# EAGLE design rectifier-power (EAGLE 5.07)
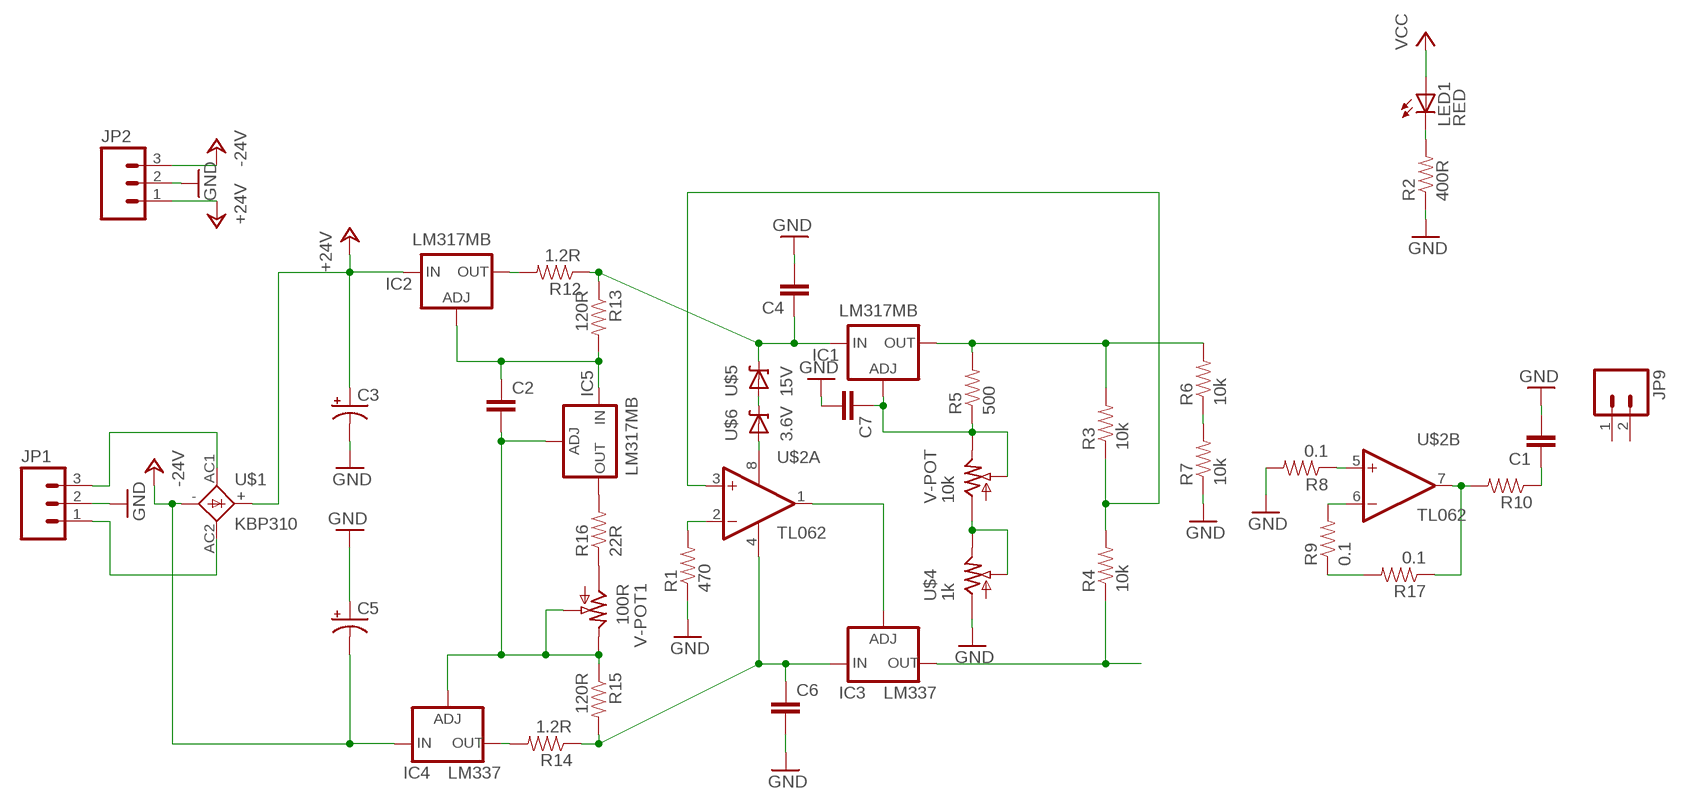
[diagram p0: schematic, sheet 1]

## Parts
C1  CAPPTH1  [CAP-PTH-5MM]
C2  CAPPTH1  [CAP-PTH-5MM]
C3  CAP_POLPTH3  [CPOL-RADIAL-1000UF-63V]
C4  CAPPTH1  [CAP-PTH-5MM]
C5  CAP_POLPTH3  [CPOL-RADIAL-1000UF-63V]
C6  CAPPTH1  [CAP-PTH-5MM]
C7  CAPPTH1  [CAP-PTH-5MM]
IC1  LM317MB  [TO220L1]
IC2  LM317MB  [TO220L1]
IC3  LM337  LM337TL  [337TL]
IC4  LM337  LM337TL  [337TL]
IC5  LM317MB  [TO220L1]
JP1  M03HT-396  [HT-396-3]
JP2  M03HT-396  [HT-396-3]
JP9  CON-02-XH  [XH-1X2-LONG-LOCK]
LED1  RED  LEDSIDELED  [OSRAM-SIDELED]
R1  470  RESISTOR1/4W  [AXIAL-0.3]
R2  400R  RESISTOR1/4W  [AXIAL-0.3]
R3  10k  RESISTOR1/4W  [AXIAL-0.3]
R4  10k  RESISTOR1/4W  [AXIAL-0.3]
R5  500  RESISTOR1/4W  [AXIAL-0.3]
R6  10k  RESISTOR1/4W  [AXIAL-0.3]
R7  10k  RESISTOR1/4W  [AXIAL-0.3]
R8  0.1  RESISTOR1/4W  [AXIAL-0.3]
R9  0.1  RESISTOR1/4W  [AXIAL-0.3]
R10  RESISTOR1/4W  [AXIAL-0.3]
R12  1.2R  RESISTOR1/4W  [AXIAL-0.3]
R13  120R  RESISTOR1/4W  [AXIAL-0.3]
R14  1.2R  RESISTOR1/4W  [AXIAL-0.3]
R15  120R  RESISTOR1/4W  [AXIAL-0.3]
R16  22R  RESISTOR1/4W  [AXIAL-0.3]
R17  0.1  RESISTOR1/4W  [AXIAL-0.3]
U$1  KBP310  RECTIFIER-BRIDGE  [KBP310]
U$2  TL062  TL062SO8  [SO08]
U$4  1k  POTPANNEL  [POT-PANNEL]
U$5  15V  DIODE-ZENERPTH  [DIODE-ZENER]
U$6  3.6V  DIODE-ZENERPTH  [DIODE-ZENER]
V-POT  10k  POTPANNEL  [POT-PANNEL]
V-POT1  100R  POTPANNEL  [POT-PANNEL]

## Nets
+24V: C3.1(+) IC2.3(IN) JP2.1 U$1.+
-24V: C5.2(-) IC4.2(IN) JP2.3 U$1.-
GND: C1.2 C3.2(-) C4.2 C5.1(+) C6.2 C7.2 JP1.2 JP2.2 R1.P$1 R2.P$1 R7.P$1 R8.P$2 U$4.A
N$1: IC1.2(OUT) R3.P$2 R5.P$2 R6.P$2
N$3: JP1.3 U$1.AC1
N$4: LED1.C R2.P$2
N$5: U$2.8(P:V+) U$6.P$2(A)
N$6: C4.1 IC1.3(IN) R12.P$1 R13.P$1 U$5.P$1(C)
N$7: JP1.1 U$1.AC2
N$8: U$5.P$2(A) U$6.P$1(C)
N$9: IC2.2(OUT) R12.P$2
N$10: C2.1 IC2.1(ADJ) IC5.3(IN) R13.P$2
N$11: IC3.1(ADJ) U$2.1(A:OUT)
N$12: R1.P$2 U$2.2(A:-IN)
N$14: IC3.3(OUT) R4.P$1
N$15: R8.P$1 U$2.5(B:+IN)
N$16: R9.P$2 U$2.6(B:-IN)
N$17: C7.1 IC1.1(ADJ) R5.P$1 V-POT.E V-POT.S
N$18: U$4.E U$4.S V-POT.A
N$19: R6.P$1 R7.P$2
N$20: IC4.3(OUT) R14.P$2
N$21: R3.P$1 R4.P$2 U$2.3(A:+IN)
N$22: C1.1 R10.P$1
N$23: R9.P$1 R17.P$2
N$24: C6.1 IC3.2(IN) R14.P$1 R15.P$2 U$2.4(P:V-)
N$25: C2.2 IC4.1(ADJ) IC5.1(ADJ) R15.P$1 V-POT1.E V-POT1.S
N$26: IC5.2(OUT) R16.P$2
N$27: R16.P$1 V-POT1.A
N$28: R10.P$2 R17.P$1 U$2.7(B:OUT)
VCC: LED1.A
Unconnected: JP9.1 JP9.2

## Library data of the parts
C1 C2 C4 C6 C7 = digital-toy:CAP: Capacitor Standard 0603 ceramic capacitor, and 0.1" leaded capacitor.
C3 C5 = digital-toy:CAP_POL: Capacitor Polarized These are standard SMD and PTH capacitors. Normally 10uF, 47uF, and 100uF in electrolytic and tantalum varieties. Always verify the external diameter of the through hole cap, it varies with capacity, voltage, and manufacturer. The EIA devices should be standard. PANASONIC_D size: 6.5mmx6.5mmx5.5mm, 100uf (taobao:6.3mmx5.5mm), same as CVL0605 153cvl0405 size: 4mmx4mmx5.5mm, 10uf (taobao:4mmx5.5mm) ct6032 typical 47uF Tantalum, comment by hyl.
IC1 IC2 IC5 = v-reg:LM317?*: 500 mA Adjustable Output Positive Voltage Regulator Source: http://www.onsemi.co.jp .. LM317M-D.PDF
IC3 IC4 = v-reg:LM337TL: VOLTAGE REGULATOR
JP1 JP2 = digital-toy:M03: Header 3 Standard 3-pin 0.1" header. Use with straight break away headers (SKU : PRT-00116), right angle break away headers (PRT-00553), swiss pins (PRT-00743), machine pins (PRT-00117), and female headers (PRT-00115). Molex polarized connector foot print use with SKU : PRT-08232 with associated crimp pins and housings.
JP9 = digital-toy:CON-02: Header 2 Standard 2-pin 0.1" header. Use with straight break away headers (SKU : PRT-00116), right angle break away headers (PRT-00553), swiss pins (PRT-00743), machine pins (PRT-00117), and female headers (PRT-00115). Molex polarized connector foot print use with SKU : PRT-08233 with associated crimp pins and housings.
LED1 = led:LED: LED OSRAM: - CHIPLED LG R971, LG N971, LY N971, LG Q971, LY Q971, LO R971, LY R971 LH N974, LH R974 LS Q976, LO Q976, LY Q976 LO Q996 - Hyper CHIPLED LW Q18S LB Q993, LB Q99A, LB R99A - SideLED LS A670, LO A670, LY A670, LG A670, LP A670 LB A673, LV A673, LT A673, LW A673 LH A674 LY A675 LS A676, LA A676, LO A676, LY A676, LW A676 LS A679, LY A679, LG A679 - Hyper Micro SIDELED® LS Y876, LA Y876, LO Y876, LY Y876 LT Y87S - SmartLED LW L88C, LW L88S LB L89C, LB L89S, LG L890 LS L89K, LO L89K, LY L89K LS L896, LA L896, LO L896, LY L896 - TOPLED LS T670, LO T670, LY T670, LG T670, LP T670 LSG T670, LSP T670, LSY T670, LOP T670, LYG T670 LG T671, LOG T671, LSG T671 LB T673, LV T673, LT T673, LW T673 LH T674 LS T676, LA T676, LO T676, LY T676, LB T676, LH T676, LSB T676, LW T676 LB T67C, LV T67C, LT T67C, LS T67K, LO T67K, LY T67K, LW E67C LS E67B, LA E67B, LO E67B, LY E67B, LB E67C, LV E67C, LT E67C LW T67C LS T679, LY T679, LG T679 LS T770, LO T770, LY T770, LG T770, LP T770 LB T773, LV T773, LT T773, LW T773 LH T774 LS E675, LA E675, LY E675, LS T675 LS T776, LA T776, LO T776, LY T776, LB T776 LHGB T686 LT T68C, LB T68C - Hyper Mini TOPLED® LB M676 - Mini TOPLED Santana® LG M470 LS M47K, LO M47K, LY M47K Source: http://www.osram.convergy.de LUXEON: - LUMILED® LXK2-PW12-R00, LXK2-PW12-S00, LXK2-PW14-U00, LXK2-PW14-V00 LXK2-PM12-R00, LXK2-PM12-S00, LXK2-PM14-U00 LXK2-PE12-Q00, LXK2-PE12-R00, LXK2-PE12-S00, LXK2-PE14-T00, LXK2-PE14-U00 LXK2-PB12-K00, LXK2-PB12-L00, LXK2-PB12-M00, LXK2-PB14-N00, LXK2-PB14-P00, LXK2-PB14-Q00 LXK2-PR12-L00, LXK2-PR12-M00, LXK2-PR14-Q00, LXK2-PR14-R00 LXK2-PD12-Q00, LXK2-PD12-R00, LXK2-PD12-S00 LXK2-PH12-R00, LXK2-PH12-S00 LXK2-PL12-P00, LXK2-PL12-Q00, LXK2-PL12-R00 Source: www.luxeon.com KINGBRIGHT: KA-3528ASYC Source: www.kingbright.com
R1-R10 R12-R17 = digital-toy:RESISTOR: Resistor Basic schematic elements and footprints for 0603, 1206, and PTH 1/10th watt (small) resistors. digital-toy copy vertical mount of axial-0.3 from rcl.lbr : the 0207/xx
U$1 = digital-toy:RECTIFIER-BRIDGE: refctifier bridge kbp310:14.4mmx11.1mm by hyl dtoy 2011/4/16
U$2 = digital-toy:TL062: Linear Devices dual Operational amplifiers, JFET-Input Stage Input offset voltage:typical 3mV(25C)
U$4 V-POT V-POT1 = digital-toy:POT: POT digital toy POT, 3296 multi turn, blue-white ... hyl 8/07/2001
U$5 U$6 = digital-toy:DIODE-ZENER: Zener Diode Production Part - 8199 3.4V Zener Voltage

## Board
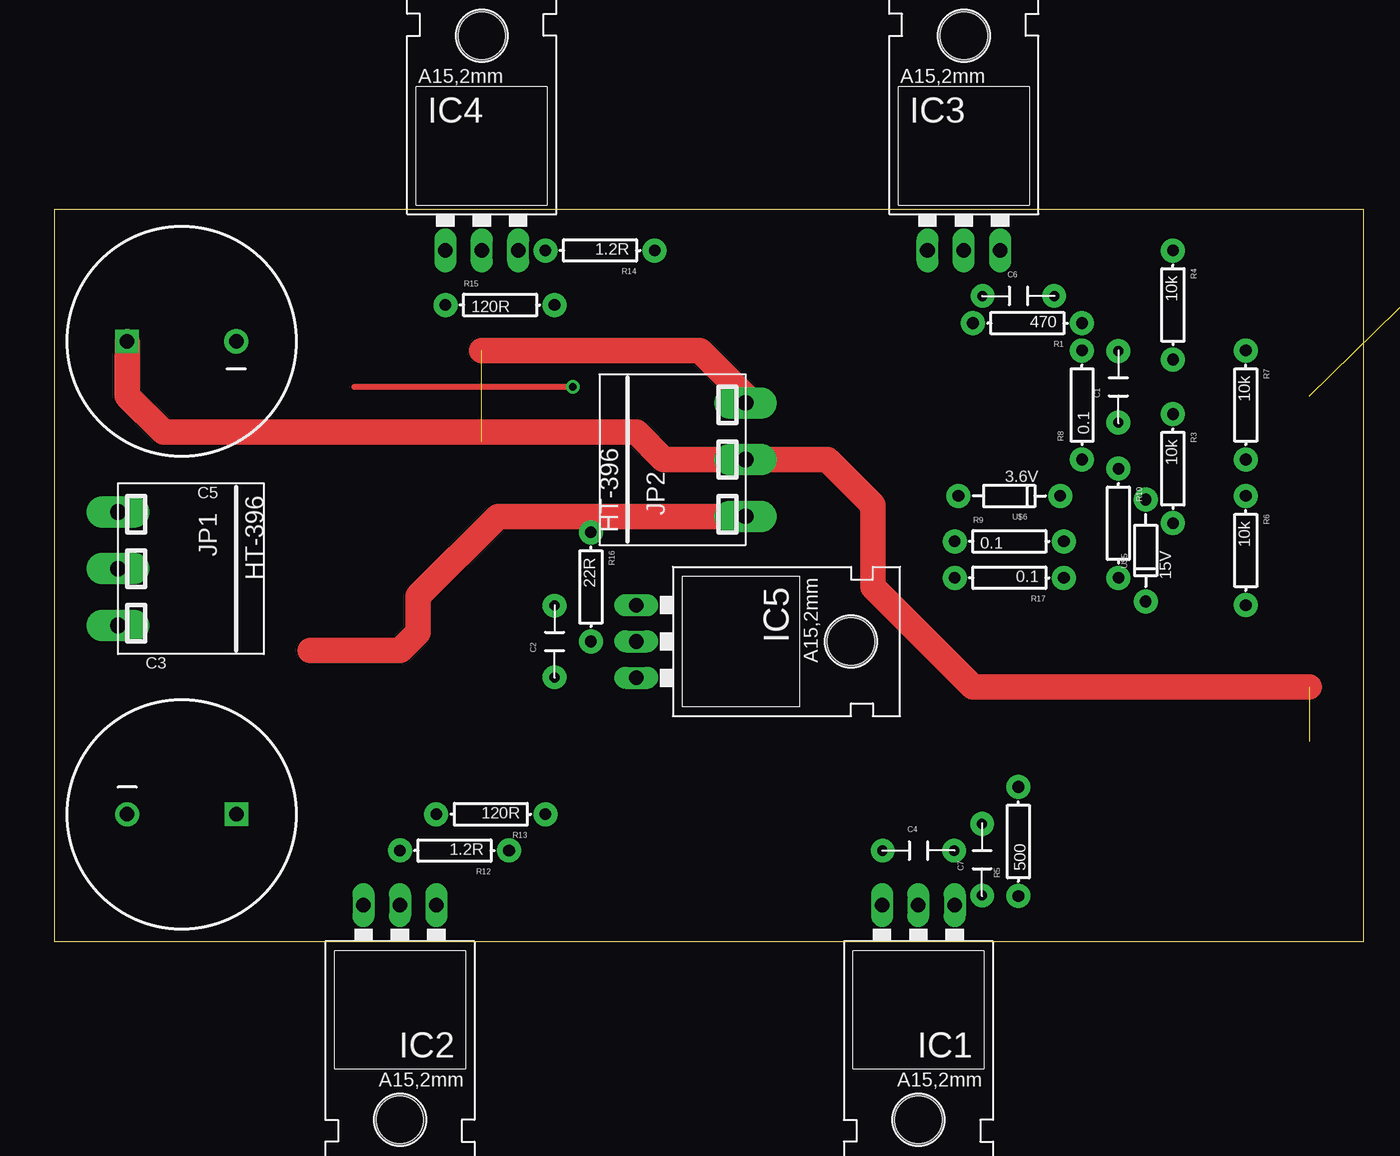
[diagram p1: board, top side]
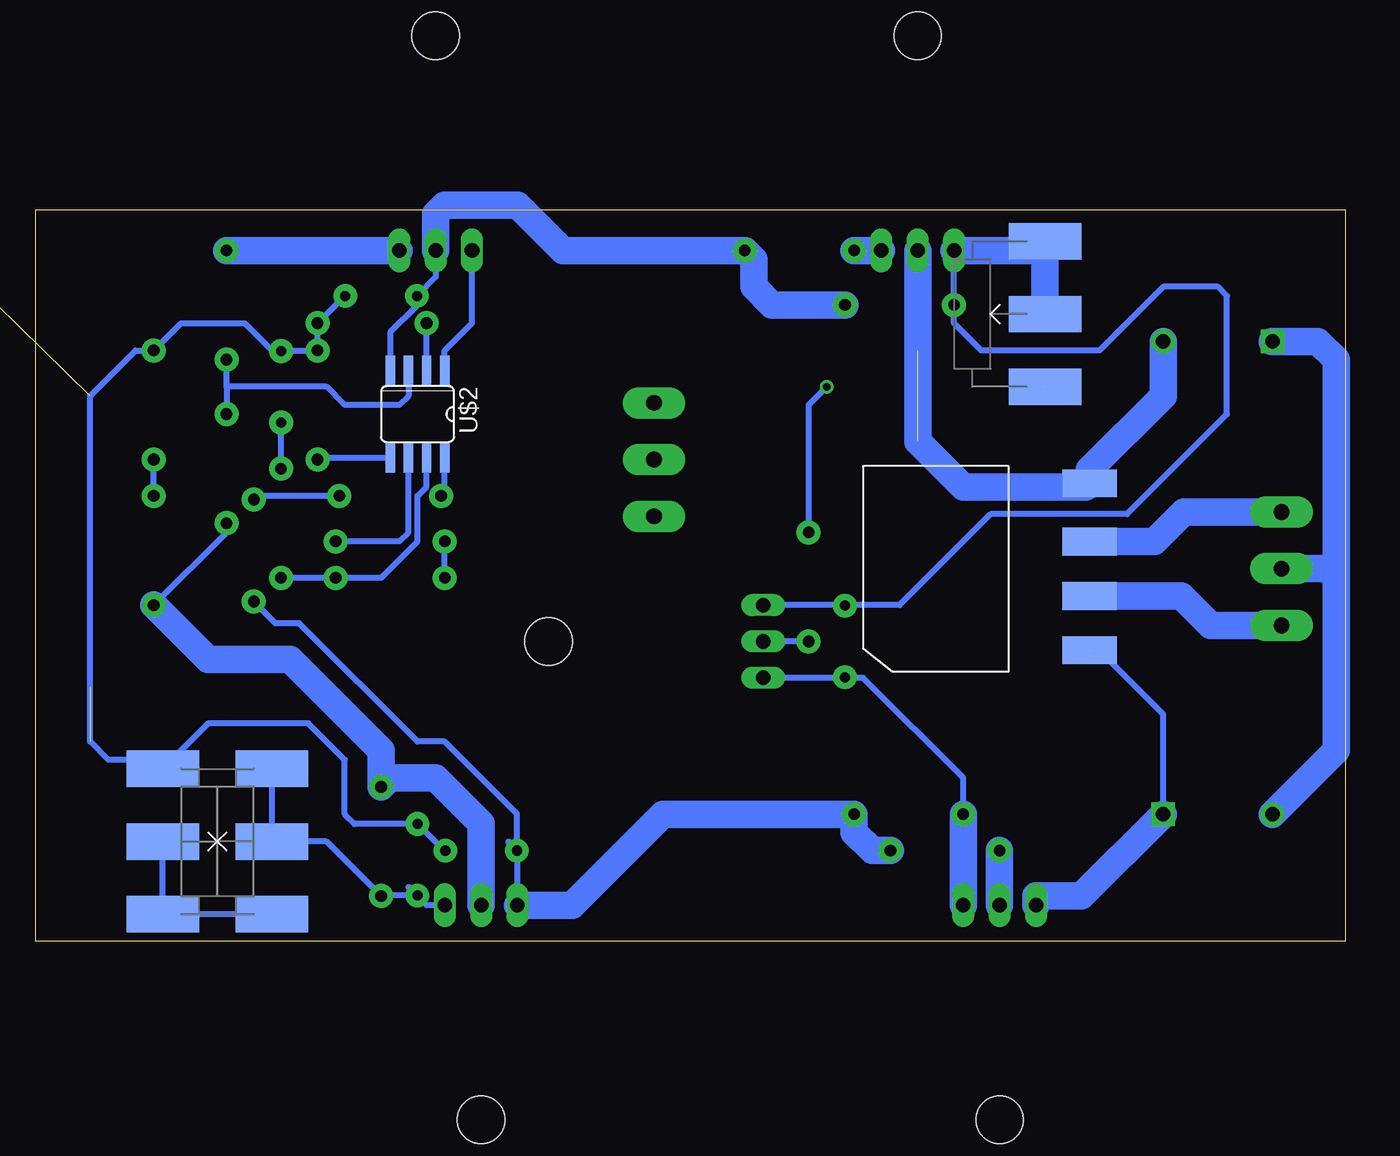
[diagram p2: board, bottom side, seen from below]

Size 91.42 x 51.1 mm. Coordinates in mm from the lower left corner, seen from the top.
Outline: 0,0 91.42,0 91.42,51.1 0,51.1 0,0
Copper layers (1*16): Top 0.035mm / dielectric 1.5mm / Bottom 0.035mm
Design rules "default": minimum track width 10mil, minimum drill 24mil, track to track 8mil, track to pad 8mil, pad to pad 8mil, via to via 8mil, smd to smd 8mil, copper to edge 40mil, drill to drill 8mil, minimum pad ring 10mil, minimum via ring 8mil, stop-mask expansion 4mil, vias tented up to drill 0mil, thermal gap 10mil

### Footprints (pad centres in the part's own frame; a part is rotated, then mirrored left to right if it is on the bottom)
CAP-PTH-5MM = drill 0.7 pad 1.651 round: 1 -2.5,0; 2 2.5,0
CPOL-RADIAL-1000UF-63V = drill 1.016 pad 1.651 square: 1 3.81,0 | drill 1.016 pad 1.676 round: 2 -3.81,0
TO220L1 = drill 1.016 long: 1 -2.54,-3.81; 2 0,-3.81; 3 2.54,-3.81 | hole 3.302: 0,11.176
337TL = drill 1.016 long: 1 -2.54,-3.81; 2 0,-3.81; 3 2.54,-3.81 | hole 3.302: 0,11.176
HT-396-3 = drill 1.1 pad 2.184 long: 1 -3.96,0; 2 0,0; 3 3.96,0
XH-1X2-LONG-LOCK = drill 1.016 pad 1.88 long: 1 1.397,0; 2 -1.397,0
OSRAM-SIDELED = smd 4 x 4: A 0,2.5; C 0,-2.5
AXIAL-0.3 = drill 0.813 pad 1.676 round: P$1 -3.81,0; P$2 3.81,0
KBP310 = smd 1.93 x 3.81: + -5.7,-10.724; - 5.954,-10.724; AC1 -1.9,-10.724; AC2 1.9,-10.724
SO08 = smd 0.66 x 2.032: 1 -1.905,-3.073; 2 -0.635,-3.073; 3 0.635,-3.073; 4 1.905,-3.073; 5 1.905,3.073; 6 0.635,3.073; 7 -0.635,3.073; 8 -1.905,3.073
POT-PANNEL = smd 2.54 x 5.08: A -6.35,0; E 3.81,0; S -1.27,0
DIODE-ZENER = drill 0.813 pad 1.676 round: P$1 -3.556,0; P$2 3.556,0

### Placement (x,y rotation side)
C1  74.3,38.73 90 top
C2  34.92,20.95 90 top
C3  8.89,8.89 0 top
C4  60.33,6.35 0 top
C5  8.89,41.91 180 top
C6  67.31,45.09 0 top
C7  64.77,5.71 90 top
IC1  60.33,-1.27 180 top
IC2  24.13,-1.27 180 top
IC3  63.5,52.07 0 top
IC4  29.84,52.07 0 top
IC5  44.45,20.95 270 top
JP1  4.45,26.04 270 top
JP2  48.26,33.66 90 top
JP9  121.28,57.15 270 top  (outside the outline)
LED1  130.81,65.41 270 top  (outside the outline)
R1  67.94,43.18 180 top
R2  119.38,65.41 0 top  (outside the outline)
R3  78.11,33.02 270 top
R4  78.11,44.45 270 top
R5  67.31,6.99 90 top
R6  83.19,27.3 270 top
R7  83.19,37.47 270 top
R8  71.75,37.47 90 top
R9  66.67,27.94 0 top
R10  74.3,29.21 270 top
R12  27.94,6.35 180 top
R13  30.48,8.89 180 top
R14  38.1,48.26 180 top
R15  31.11,44.45 0 top
R16  37.47,24.77 270 top
R17  66.67,25.4 180 top
U$1  28.57,26.04 90 bottom
U$2  64.77,36.83 180 bottom
U$4  82.55,5.71 270 bottom
U$5  76.2,27.3 90 top
U$6  66.67,31.11 180 top
V-POT  74.93,8.26 90 bottom
V-POT1  20.95,45.09 90 bottom

### Tracks (layer width: path | path; a pad name or v marks a point on that pad's centre or on a via)
+24V  (1 unrouted)
  Top 1.778: JP2.1 30.96,29.7 25.4,24.13 25.4,21.59 24.13,20.32 17.87,20.32 U$1.+
  Bottom 0.406: C3.1 12.7,15.88 17.14,20.32 17.84,20.32 U$1.+
  Bottom 1.93: C3.1 18.41,3.17 21.59,3.17 IC2.3
-24V  (1 unrouted)
  Top 1.778: JP2.3 48.26,38.1 45.09,41.27 29.84,41.27
  Bottom 1.93: C5.2 12.7,38.1 17.85,32.95 U$1.- 18.09,31.75 26.67,31.75 29.84,34.92 IC4.2
GND  (2 unrouted)
  Top 1.778: C5.1 5.08,38.1 7.62,35.56 40.64,35.56 42.55,33.66 JP2.2 53.98,33.66 57.15,30.48 57.15,24.77 64.14,17.78 87.63,17.78
  Bottom 0.406: C6.2 69.85,45.09 R1.P$1 R8.P$2 74.25,41.27 C1.2 74.89,41.23 76.83,43.18 81.28,43.18 R7.P$1 84.45,41.27 87.63,38.1 87.63,13.97 86.36,12.7 83.19,12.7 U$4.A 79.38,15.24 72.39,15.24 69.85,12.7 69.85,8.89 69.17,8.21 C7.2 62.91,6.35 C4.2
  Bottom 1.93: JP1.2 1.27,26.04 0.64,25.4 | 0.64,25.4 0.64,13.34 C3.2 | C5.1 1.91,41.91 0.64,40.64 0.64,25.4
N$1
  Bottom 0.406: R3.P$2 78.11,28.57 R6.P$2
  Bottom 1.93: IC1.2 60.33,8.26 63.5,11.43 66.67,11.43 R5.P$2 67.31,13.34 73.66,19.68 79.38,19.68 R6.P$2
N$3
  Bottom 1.93: JP1.3 9.38,22.07 11.43,24.13 U$1.AC1
N$4  (1 unrouted)
N$5
  Bottom 0.406: U$2.8 62.87,31.37 U$6.P$2
N$6
  Bottom 0.406: IC1.3 57.78,6.35 58.42,6.99 58.42,6.95 C4.1 57.83,8.93 62.87,13.97 64.77,13.97 73.03,22.23 74.68,22.23 U$5.P$1
  Bottom 1.93: R12.P$1 33.02,6.35 34.29,7.62 R13.P$1 47.62,8.89 53.98,2.54 IC1.3
N$7
  Bottom 1.93: JP1.1 11.28,30 13.34,27.94 U$1.AC2
N$8
  Bottom 0.406: U$6.P$1 75.95,31.11 U$5.P$2
N$9
  Bottom 1.93: IC2.2 R12.P$2
N$10
  Bottom 0.406: IC5.3 34.97,18.41 C2.1 34.88,18.41 33.66,18.41 26.67,11.43 R13.P$2
  Bottom 1.93: IC2.1 R13.P$2
N$11
  Bottom 0.406: IC3.1 60.96,43.18 62.87,41.27 U$2.1
N$12
  Bottom 0.406: U$2.2 R1.P$2
N$14
  Bottom 1.93: IC3.3 R4.P$1
N$15
  Bottom 0.406: U$2.5 71.65,33.76 R8.P$1
N$16
  Bottom 0.406: R9.P$2 66.04,27.94 65.41,28.57 U$2.6
N$17
  Bottom 0.406: IC1.1 64.14,2.54 65.41,3.81 65.36,3.81 C7.1 67.27,3.21 R5.P$1 71.12,6.99 V-POT.S V-POT.E
N$18
  Bottom 0.406: V-POT.A U$4.E U$4.S
N$19
  Bottom 0.406: R6.P$1 R7.P$2
N$20
  Bottom 1.93: IC4.3 R14.P$2
N$21
  Bottom 0.406: 78.11,38.73 R3.P$1 78.11,36.2 | 78.11,38.73 R4.P$2 | U$2.3 65.41,38.1 66.04,37.47 69.85,37.47 71.12,38.73 78.11,38.73
N$22
  Bottom 0.406: R10.P$1 C1.1
N$23
  Bottom 0.406: R17.P$2 R9.P$1
N$24
  Bottom 0.406: IC3.2 63.5,46.4 C6.1 64.81,44.41 66.67,42.55 U$2.4
  Bottom 1.93: R15.P$2 40.01,44.45 41.27,45.72 41.27,47.62 R14.P$1 54.61,48.26 57.78,51.44 62.87,51.44 63.5,50.8 IC3.2
N$25
  Bottom 0.406: IC5.1 34.97,23.5 C2.2 34.88,23.5 31.11,23.5 24.77,29.84 15.24,29.84 8.26,36.83 8.26,45.09 8.89,45.72 12.7,45.72 17.14,41.27 25.4,41.27 27.3,43.18 R15.P$1 IC4.1
  Bottom 1.93: IC4.1 21.59,48.26 V-POT1.E V-POT1.S
N$26
  Bottom 0.406: R16.P$2 IC5.2
N$27  (via drill 0.51)  (1 unrouted)
  Top 0.406: V-POT1.A v36.2,38.73
  Bottom 0.406: R16.P$1 37.47,37.47 v36.2,38.73
N$28
  Bottom 0.406: U$2.7 64.14,31.75 64.77,31.11 64.77,27.94 67.31,25.4 R17.P$1 R10.P$2